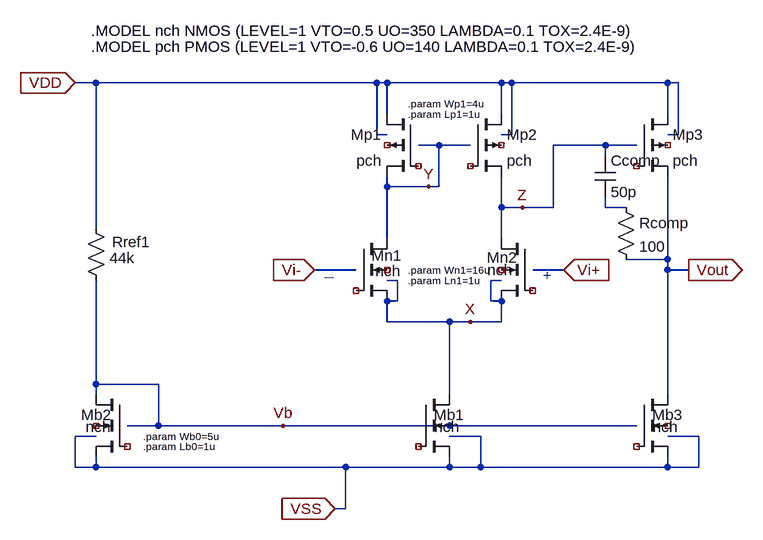
[diagram p0: schematic OpAmp26.asc]
OpAmp26.asc, the LTspice schematic file:
Version 4
SHEET 1 1348 760
WIRE -432 32 -464 32
WIRE 0 32 -432 32
WIRE 16 32 0 32
WIRE 192 32 16 32
WIRE 208 32 192 32
WIRE 448 32 208 32
WIRE 464 32 448 32
WIRE 16 80 16 32
WIRE 192 80 192 32
WIRE 448 80 448 32
WIRE 0 112 0 32
WIRE 16 112 0 112
WIRE 208 112 208 32
WIRE 208 112 192 112
WIRE 464 112 464 32
WIRE 464 112 448 112
WIRE 96 128 64 128
WIRE 144 128 96 128
WIRE 352 128 272 128
WIRE 400 128 352 128
WIRE 352 144 352 128
WIRE 16 192 16 176
WIRE 80 192 16 192
WIRE 96 192 96 128
WIRE 96 192 80 192
WIRE 192 224 192 176
WIRE 224 224 192 224
WIRE 272 224 272 128
WIRE 272 224 224 224
WIRE 352 224 352 208
WIRE 384 224 352 224
WIRE -432 256 -432 32
WIRE 16 272 16 192
WIRE 192 272 192 224
WIRE 448 304 448 176
WIRE 448 304 384 304
WIRE -32 320 -96 320
WIRE 288 320 240 320
WIRE 448 320 448 304
WIRE 480 320 448 320
WIRE 32 336 16 336
WIRE 192 336 176 336
WIRE 32 368 32 336
WIRE 32 368 16 368
WIRE 176 368 176 336
WIRE 192 368 176 368
WIRE 16 400 16 368
WIRE 112 400 16 400
WIRE 144 400 112 400
WIRE 192 400 192 368
WIRE 192 400 144 400
WIRE -432 496 -432 336
WIRE -336 496 -432 496
WIRE -432 512 -432 496
WIRE 112 512 112 400
WIRE 448 512 448 320
WIRE -336 560 -336 496
WIRE -336 560 -384 560
WIRE -144 560 -336 560
WIRE 64 560 -144 560
WIRE 400 560 64 560
WIRE -432 576 -464 576
WIRE 160 576 112 576
WIRE 496 576 448 576
WIRE -464 624 -464 576
WIRE -432 624 -432 608
WIRE -432 624 -464 624
WIRE -48 624 -432 624
WIRE 112 624 112 608
WIRE 112 624 -48 624
WIRE 160 624 160 576
WIRE 160 624 112 624
WIRE 448 624 448 608
WIRE 448 624 160 624
WIRE 496 624 496 576
WIRE 496 624 448 624
WIRE -48 688 -48 624
WIRE -48 688 -64 688
FLAG -144 560 Vb
FLAG 80 192 Y
FLAG 480 320 Vout
IOPIN 480 320 Out
FLAG 144 400 X
FLAG -96 320 Vi-
IOPIN -96 320 In
FLAG 288 320 Vi+
IOPIN 288 320 In
FLAG 224 224 Z
FLAG -464 32 VDD
IOPIN -464 32 In
FLAG -64 688 VSS
IOPIN -64 688 In
SYMBOL nmos4 -32 272 R0
WINDOW 0 24 26 Left 2
WINDOW 3 30 50 Left 2
SYMATTR InstName Mn1
SYMATTR Value nch
SYMATTR Value2 l='Ln1' w='Wn1' m=1
SYMBOL nmos4 64 512 R0
WINDOW 0 24 31 Left 2
WINDOW 3 25 50 Left 2
SYMATTR InstName Mb1
SYMATTR Value nch
SYMATTR Value2 l='Lb0' w='Wb0' m=1
SYMBOL nmos4 240 272 M0
WINDOW 0 23 29 Left 2
WINDOW 3 31 48 Left 2
SYMATTR InstName Mn2
SYMATTR Value nch
SYMATTR Value2 l='Ln1' w='Wn1' m=1
SYMBOL pmos4 64 80 M0
SYMATTR InstName Mp1
SYMATTR Value pch
SYMATTR Value2 l='Lp1' w='Wp1' m=1
SYMBOL pmos4 144 80 R0
SYMATTR InstName Mp2
SYMATTR Value pch
SYMATTR Value2 l='Lp1' w='Wp1' m=1
SYMBOL res -448 240 R0
WINDOW 0 41 37 Left 2
WINDOW 3 37 62 Left 2
SYMATTR InstName Rref1
SYMATTR Value 44k
SYMBOL nmos4 -384 512 M0
WINDOW 0 24 31 Left 2
WINDOW 3 25 50 Left 2
SYMATTR InstName Mb2
SYMATTR Value nch
SYMATTR Value2 l='Lb0' w='Wb0' m=1
SYMBOL nmos4 400 512 R0
WINDOW 0 24 31 Left 2
WINDOW 3 25 50 Left 2
SYMATTR InstName Mb3
SYMATTR Value nch
SYMATTR Value2 l='Lb0' w='Wb0' m=2
SYMBOL pmos4 400 80 R0
SYMATTR InstName Mp3
SYMATTR Value pch
SYMATTR Value2 l='Lp1' w='Wp1' m=10
SYMBOL cap 336 144 R0
SYMATTR InstName Ccomp
SYMATTR Value 50p
SYMBOL res 368 208 R0
SYMATTR InstName Rcomp
SYMATTR Value 100
TEXT 48 336 Left 1 !.param Ln1=1u
TEXT 48 320 Left 1 !.param Wn1=16u
TEXT -360 592 Left 1 !.param Lb0=1u
TEXT -360 576 Left 1 !.param Wb0=5u
TEXT 48 64 Left 1 !.param Wp1=4u
TEXT 48 80 Left 1 !.param Lp1=1u
TEXT 256 328 Left 2 ;+
TEXT -80 320 Left 2 ;_
TEXT -440 -48 Left 2 !.MODEL nch NMOS (LEVEL=1 VTO=0.5 UO=350 LAMBDA=0.1 TOX=2.4E-9)
TEXT -440 -24 Left 2 !.MODEL pch PMOS (LEVEL=1 VTO=-0.6 UO=140 LAMBDA=0.1 TOX=2.4E-9)

The netlist it stands for:
* OpAmp26.asc
* Mn1: nch l='Ln1' w='Wn1' m=1 (symbol nmos4 not certain, pin order unknown); nets seen at it: X, Y
* Mb1: nch l='Lb0' w='Wb0' m=1 (symbol nmos4 not certain, pin order unknown); nets seen at it: Vb, VSS, X
* Mn2: nch l='Ln1' w='Wn1' m=1 (symbol nmos4 not certain, pin order unknown); nets seen at it: X, Z
* Mp1: pch l='Lp1' w='Wp1' m=1 (symbol pmos4 not certain, pin order unknown); nets seen at it: VDD, Y
* Mp2: pch l='Lp1' w='Wp1' m=1 (symbol pmos4 not certain, pin order unknown); nets seen at it: VDD, Z
Rref1 VDD Vb 44k
* Mb2: nch l='Lb0' w='Wb0' m=1 (symbol nmos4 not certain, pin order unknown); nets seen at it: Vb, VSS
* Mb3: nch l='Lb0' w='Wb0' m=2 (symbol nmos4 not certain, pin order unknown); nets seen at it: Vout, VSS
* Mp3: pch l='Lp1' w='Wp1' m=10 (symbol pmos4 not certain, pin order unknown); nets seen at it: VDD, Vout
Ccomp Z N001 50p
Rcomp N001 Vout 100
.param Ln1=1u
.param Wn1=16u
.param Lb0=1u
.param Wb0=5u
.param Wp1=4u
.param Lp1=1u
* +
* _
.MODEL nch NMOS (LEVEL=1 VTO=0.5 UO=350 LAMBDA=0.1 TOX=2.4E-9)
.MODEL pch PMOS (LEVEL=1 VTO=-0.6 UO=140 LAMBDA=0.1 TOX=2.4E-9)
.backanno
.end